# Altium schematic sheet TestHBridge.SchDoc
size A3
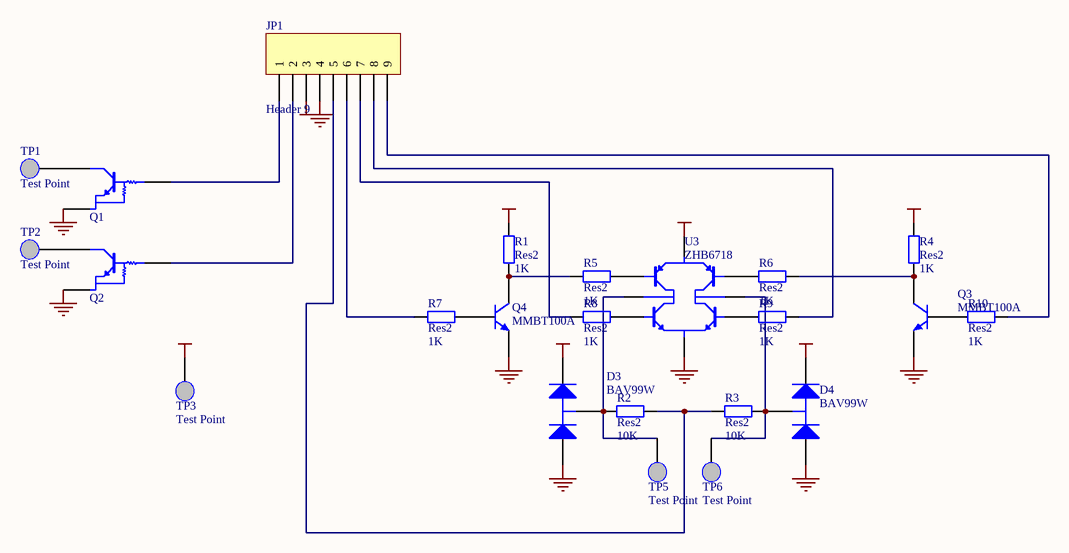
[diagram p0: TestHBridge.SchDoc]

## Parts
D3  BAV99W  [SOT-323]
D4  BAV99W  [SOT-323]
JP1  Header 9  [HDR1X9]
Q1  UN2212  [SO-G3]  (value not drawn)
Q2  UN2212  [SO-G3]  (value not drawn)
Q3  MMBT100A  [SO-G3]
Q4  MMBT100A  [SO-G3]
R1  Res2  value 1K  [CC2012-0805]
R2  Res2  value 10K  [CC2012-0805]
R3  Res2  value 10K  [CC2012-0805]
R4  Res2  value 1K  [CC2012-0805]
R5  Res2  value 1K  [CC2012-0805]
R6  Res2  value 1K  [CC2012-0805]
R7  Res2  value 1K  [CC2012-0805]
R8  Res2  value 1K  [CC2012-0805]
R9  Res2  value 1K  [CC2012-0805]
R10  Res2  value 1K  [CC2012-0805]
TP1  Test Point  [TestPoint]
TP2  Test Point  [TestPoint]
TP3  Test Point  [TestPoint]
TP5  Test Point  [TestPoint]
TP6  Test Point  [TestPoint]
U3  ZHB6718  [SOT223-8]

## Nets
GND: D3.1(A) D4.1(A) JP1.4 Q1.2(E) Q2.2(E) Q3.2(E) Q4.2(E) U3.2(e2,e3)
Vdd: D3.2(K) D4.2(K) JP1.3 R1.2 R4.2 TP3.1 U3.6(e1,e4)
NetD3_3: D3.3(C) R2.1 TP5.1 U3.5(c1,c2)
NetD4_3: D4.3(C) R3.2 TP6.1 U3.7(c3,c4)
NetJP1_1: JP1.1 Q1.1(B)
NetJP1_2: JP1.2 Q2.1(B)
NetJP1_5: JP1.5 R2.2 R3.1
NetJP1_6: JP1.6 R7.2
NetJP1_7: JP1.7 R8.1
NetJP1_8: JP1.8 R9.2
NetJP1_9: JP1.9 R10.2
NetQ1_3: Q1.3(C) TP1.1
NetQ2_3: Q2.3(C) TP2.1
NetQ3_1: Q3.1(B) R10.1
NetQ3_3: Q3.3(C) R4.1 R6.2
NetQ4_1: Q4.1(B) R7.1
NetQ4_3: Q4.3(C) R1.1 R5.1
NetR5_2: R5.2 U3.4(b1)
NetR6_1: R6.1 U3.8(b4)
NetR8_2: R8.2 U3.3(b2)
NetR9_1: R9.1 U3.1(b3)

## Library data of the parts
D3 D4 = BAV99W: Silicon Switching Diode Array for High-Speed Switching; Package Information: Latest Revision: Sep-2001; Published: 21-Mar-2003; Datasheet: Latest Revision: Oct-1999; Package Reference: SOT-323; Publisher: Altium Limited
JP1 = Header 9: Header, 9-Pin; Revision: 17-Jul-2002: Re-released for DXP Platform.; Publisher: Altium Limited
Q1 Q2 = UN2212: Bias Resistor Transistor
Q3 Q4 = MMBT100A: General Purpose Amplifier NPN Silicon; Package Information: Latest Revision: 1997; Published: 29-Sep-2000; Revision: 17-Jul-2002: Re-released for DXP Platform.; Datasheet: Latest Revision: 1996; Package Reference: 318-08; Publisher: Altium Limited
R1-R10 = Res2: Resistor; Published: 8-Jun-2000; Revision: July-2002: Re-released for DXP Platform.; Publisher: Altium Limited
TP1-TP3 TP5 TP6 = TestPoint